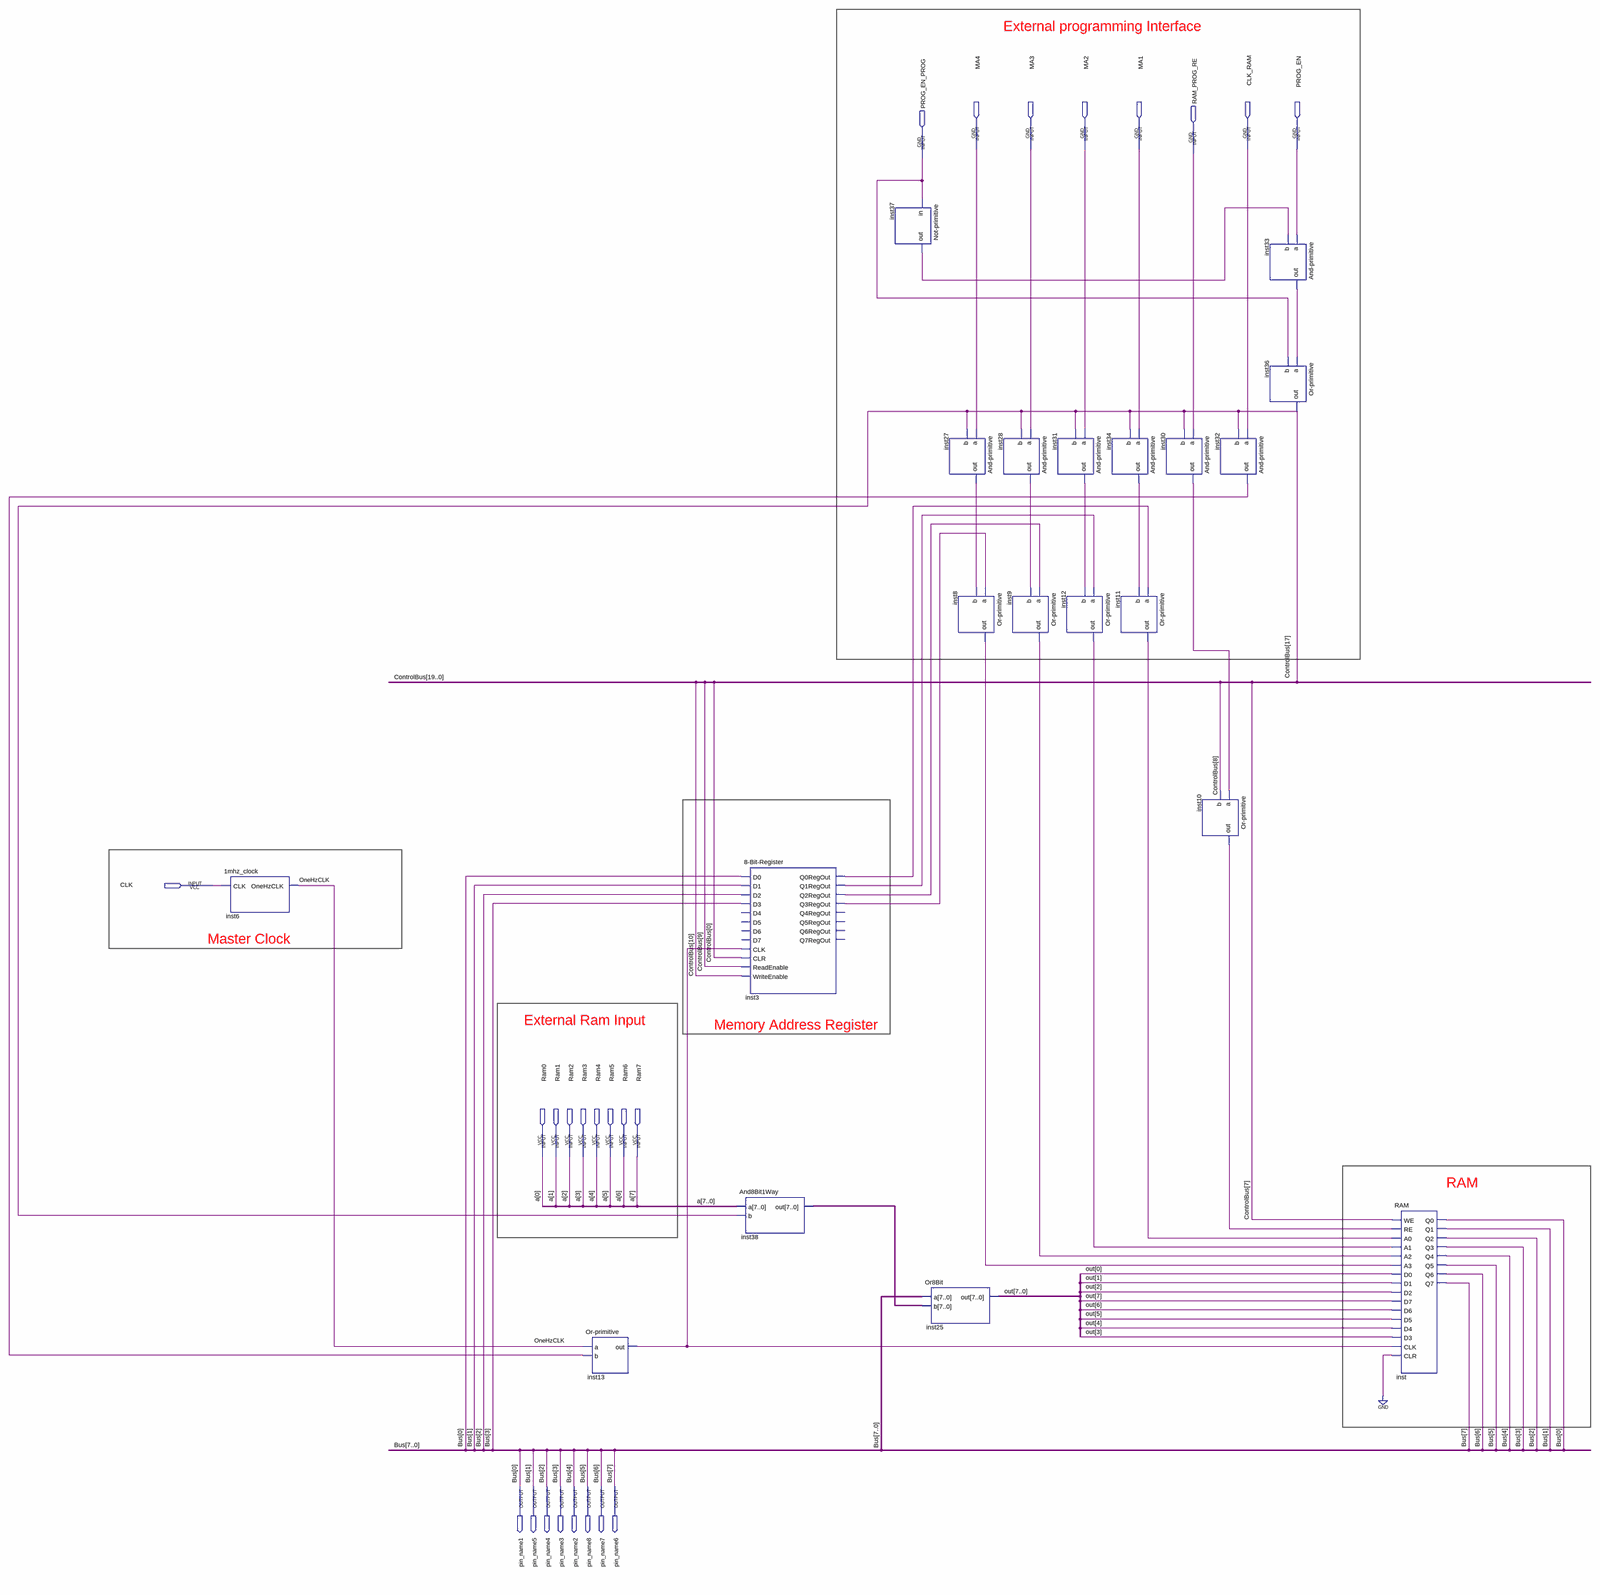
[diagram p0: schematic sheet, whole]
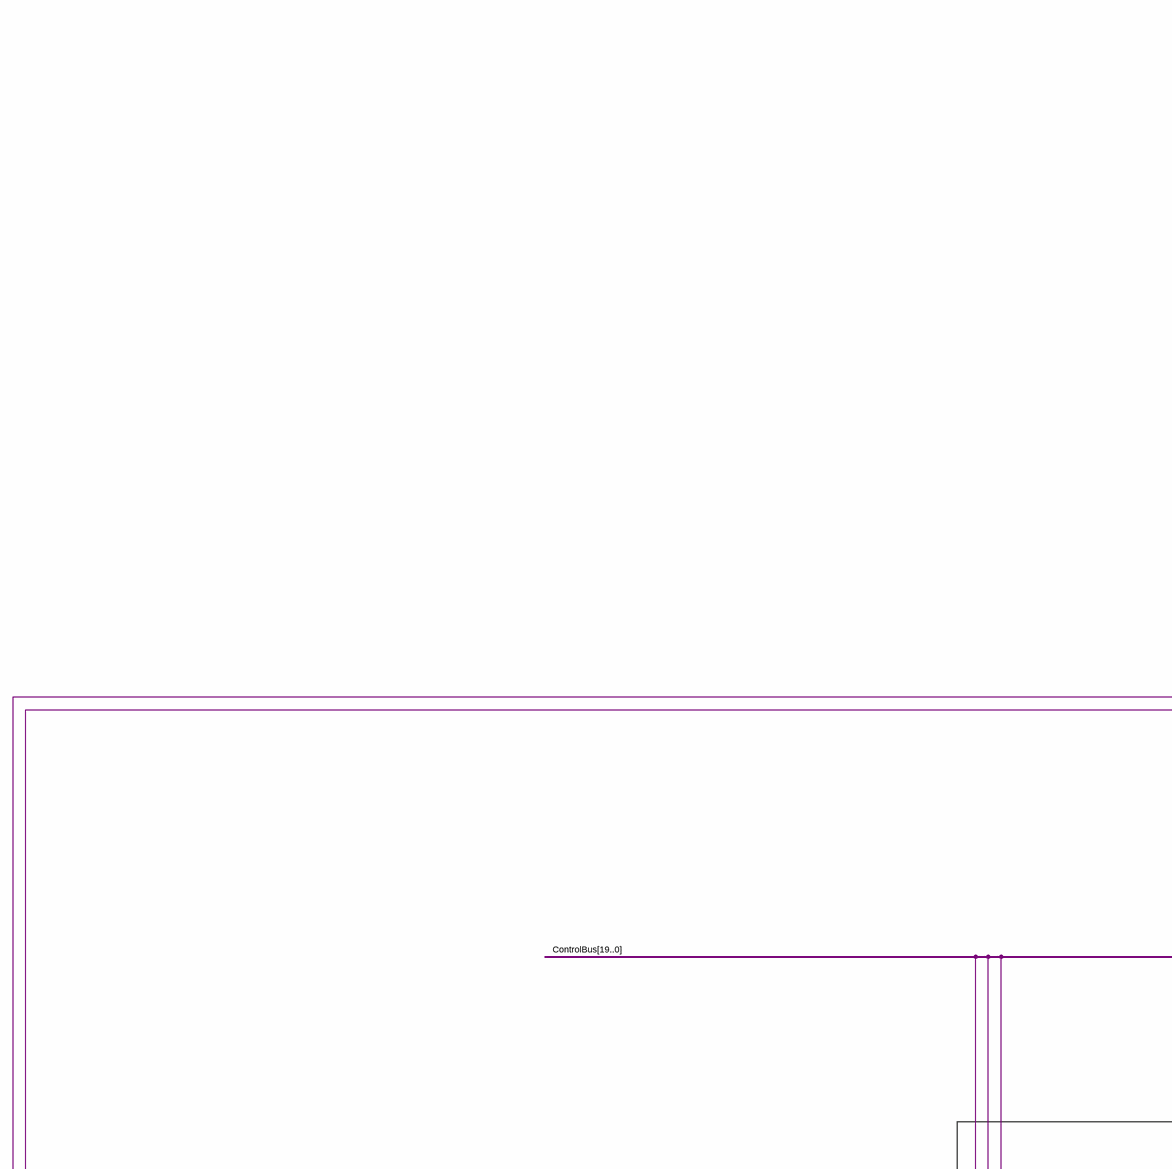
[diagram p1: schematic sheet, upper left part]
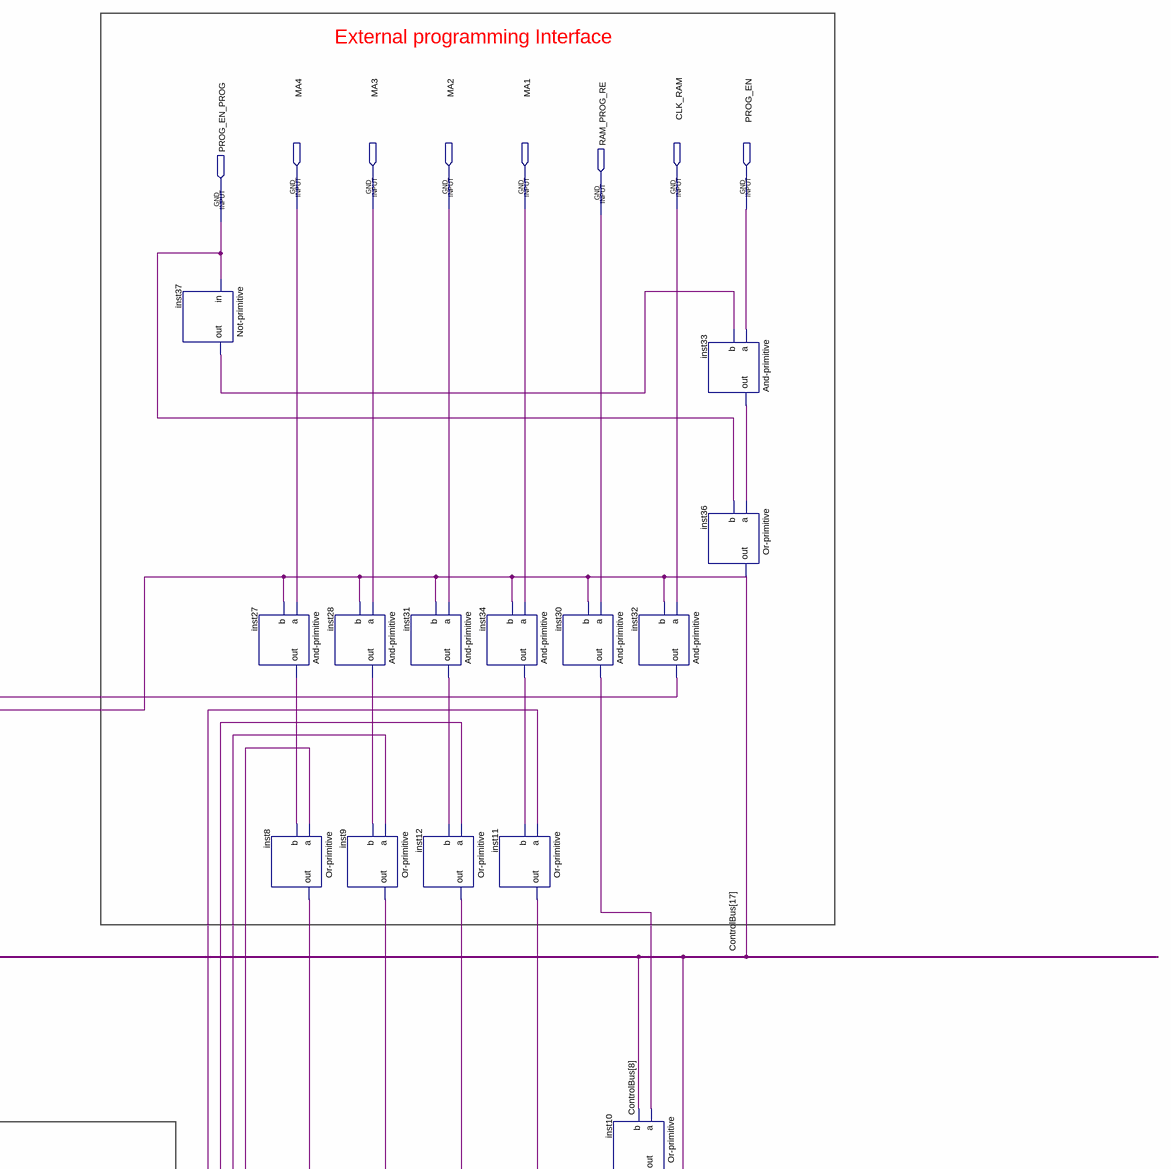
[diagram p2: schematic sheet, upper right part]
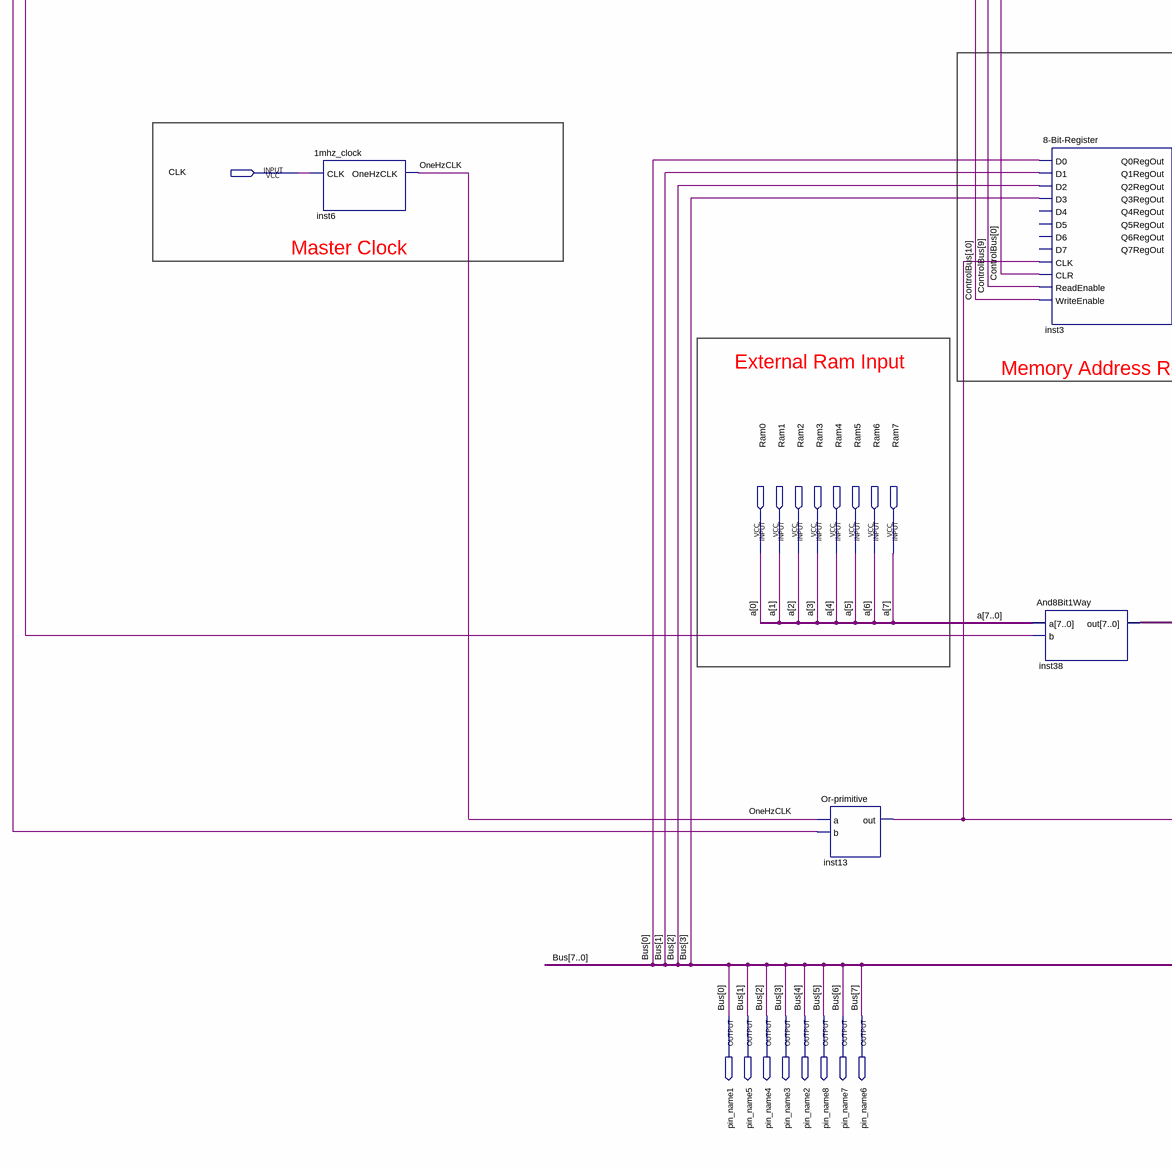
[diagram p3: schematic sheet, lower left part]
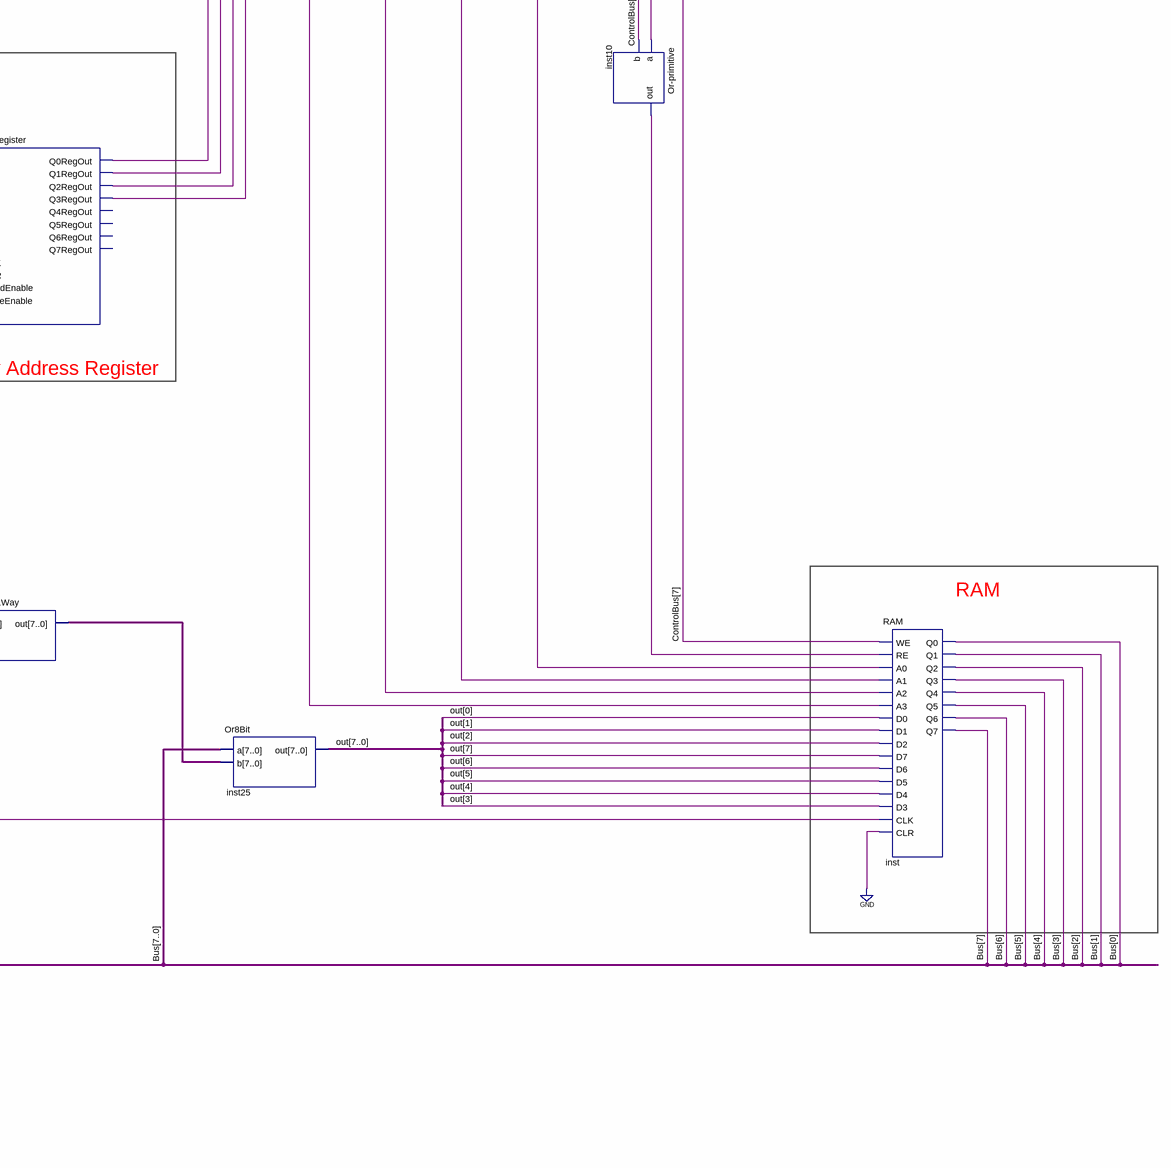
[diagram p4: schematic sheet, lower right part]
// Quartus schematic 8-Bit-Computer.bdf as structural Verilog: 20 symbols, 25 pins
module \8-Bit-Computer  (
  input  MA4,
  input  MA3,
  input  MA2,
  input  MA1,
  input  CLK_RAM,
  input  PROG_EN,
  input  RAM_PROG_RE,
  input  PROG_EN_PROG,
  input  CLK,
  input  Ram0,
  input  Ram1,
  input  Ram2,
  input  Ram3,
  input  Ram4,
  input  Ram5,
  input  Ram6,
  input  Ram7,
  output pin_name1,
  output pin_name5,
  output pin_name4,
  output pin_name3,
  output pin_name2,
  output pin_name8,
  output pin_name7,
  output pin_name6
);

  wire inst3_q0regout, inst3_q1regout, inst3_q2regout, inst3_q3regout, inst8_out, inst9_out, inst10_out,
       inst11_out, inst12_out, inst13_out, inst27_out, inst28_out, inst30_out, inst31_out, inst32_out,
       inst33_out, inst34_out, inst37_out, OneHzCLK;
  wire [7:0] inst38_out, out;
  wire [17:0] ControlBus;

  \1mhz_clock  inst6 (.CLK(CLK), .OneHzCLK(OneHzCLK));
  \Or-primitive  inst13 (.a(OneHzCLK), .b(inst32_out), .out(inst13_out));
  \8-Bit-Register  inst3 (
    .D0(pin_name1), .D1(pin_name5), .D2(pin_name4), .D3(pin_name3), .CLK(inst13_out), .CLR(ControlBus[0]),
    .ReadEnable(ControlBus[9]), .WriteEnable(ControlBus[10]), .Q0RegOut(inst3_q0regout),
    .Q1RegOut(inst3_q1regout), .Q2RegOut(inst3_q2regout), .Q3RegOut(inst3_q3regout));  // open: D4, D5, D6, D7, Q4RegOut, Q5RegOut, Q6RegOut, Q7RegOut
  And8Bit1Way inst38 (.a({Ram7, Ram6, Ram5, Ram4, Ram3, Ram2, Ram1, Ram0}), .b(ControlBus[17]), .out(inst38_out));
  \Not-primitive  inst37 (.in(PROG_EN_PROG), .out(inst37_out));
  \And-primitive  inst27 (.a(MA4), .b(ControlBus[17]), .out(inst27_out));
  \Or-primitive  inst8 (.a(inst3_q3regout), .b(inst27_out), .out(inst8_out));
  Or8Bit inst25 (
    .a({pin_name6, pin_name7, pin_name8, pin_name2, pin_name3, pin_name4, pin_name5, pin_name1}),
    .b(inst38_out), .out(out));
  \And-primitive  inst28 (.a(MA3), .b(ControlBus[17]), .out(inst28_out));
  \Or-primitive  inst9 (.a(inst3_q2regout), .b(inst28_out), .out(inst9_out));
  \And-primitive  inst31 (.a(MA2), .b(ControlBus[17]), .out(inst31_out));
  \Or-primitive  inst12 (.a(inst3_q1regout), .b(inst31_out), .out(inst12_out));
  \And-primitive  inst34 (.a(MA1), .b(ControlBus[17]), .out(inst34_out));
  \Or-primitive  inst11 (.a(inst3_q0regout), .b(inst34_out), .out(inst11_out));
  \And-primitive  inst30 (.a(RAM_PROG_RE), .b(ControlBus[17]), .out(inst30_out));
  \Or-primitive  inst10 (.a(inst30_out), .b(ControlBus[8]), .out(inst10_out));
  \And-primitive  inst32 (.a(CLK_RAM), .b(ControlBus[17]), .out(inst32_out));
  \And-primitive  inst33 (.a(PROG_EN), .b(inst37_out), .out(inst33_out));
  \Or-primitive  inst36 (.a(inst33_out), .b(PROG_EN_PROG), .out(ControlBus[17]));
  RAM inst (
    .WE(ControlBus[7]), .RE(inst10_out), .A0(inst11_out), .A1(inst12_out), .A2(inst9_out), .A3(inst8_out),
    .D0(out[0]), .D1(out[1]), .D2(out[2]), .D7(out[7]), .D6(out[6]), .D5(out[5]), .D4(out[4]), .D3(out[3]),
    .CLK(inst13_out), .CLR(1'b0), .Q0(pin_name1), .Q1(pin_name5), .Q2(pin_name4), .Q3(pin_name3),
    .Q4(pin_name2), .Q5(pin_name8), .Q6(pin_name7), .Q7(pin_name6));

  // Other names for the same wires on the sheet: a[7:0] = {Ram7, Ram6, Ram5, Ram4, Ram3, Ram2, Ram1, Ram0};
  //   Bus[7:0] = {pin_name6, pin_name7, pin_name8, pin_name2, pin_name3, pin_name4, pin_name5, pin_name1}

  // Notes on the sheet:
  //   External programming Interface
  //   Master Clock
  //   External Ram Input
  //   Memory Address Register
  //   RAM
endmodule
